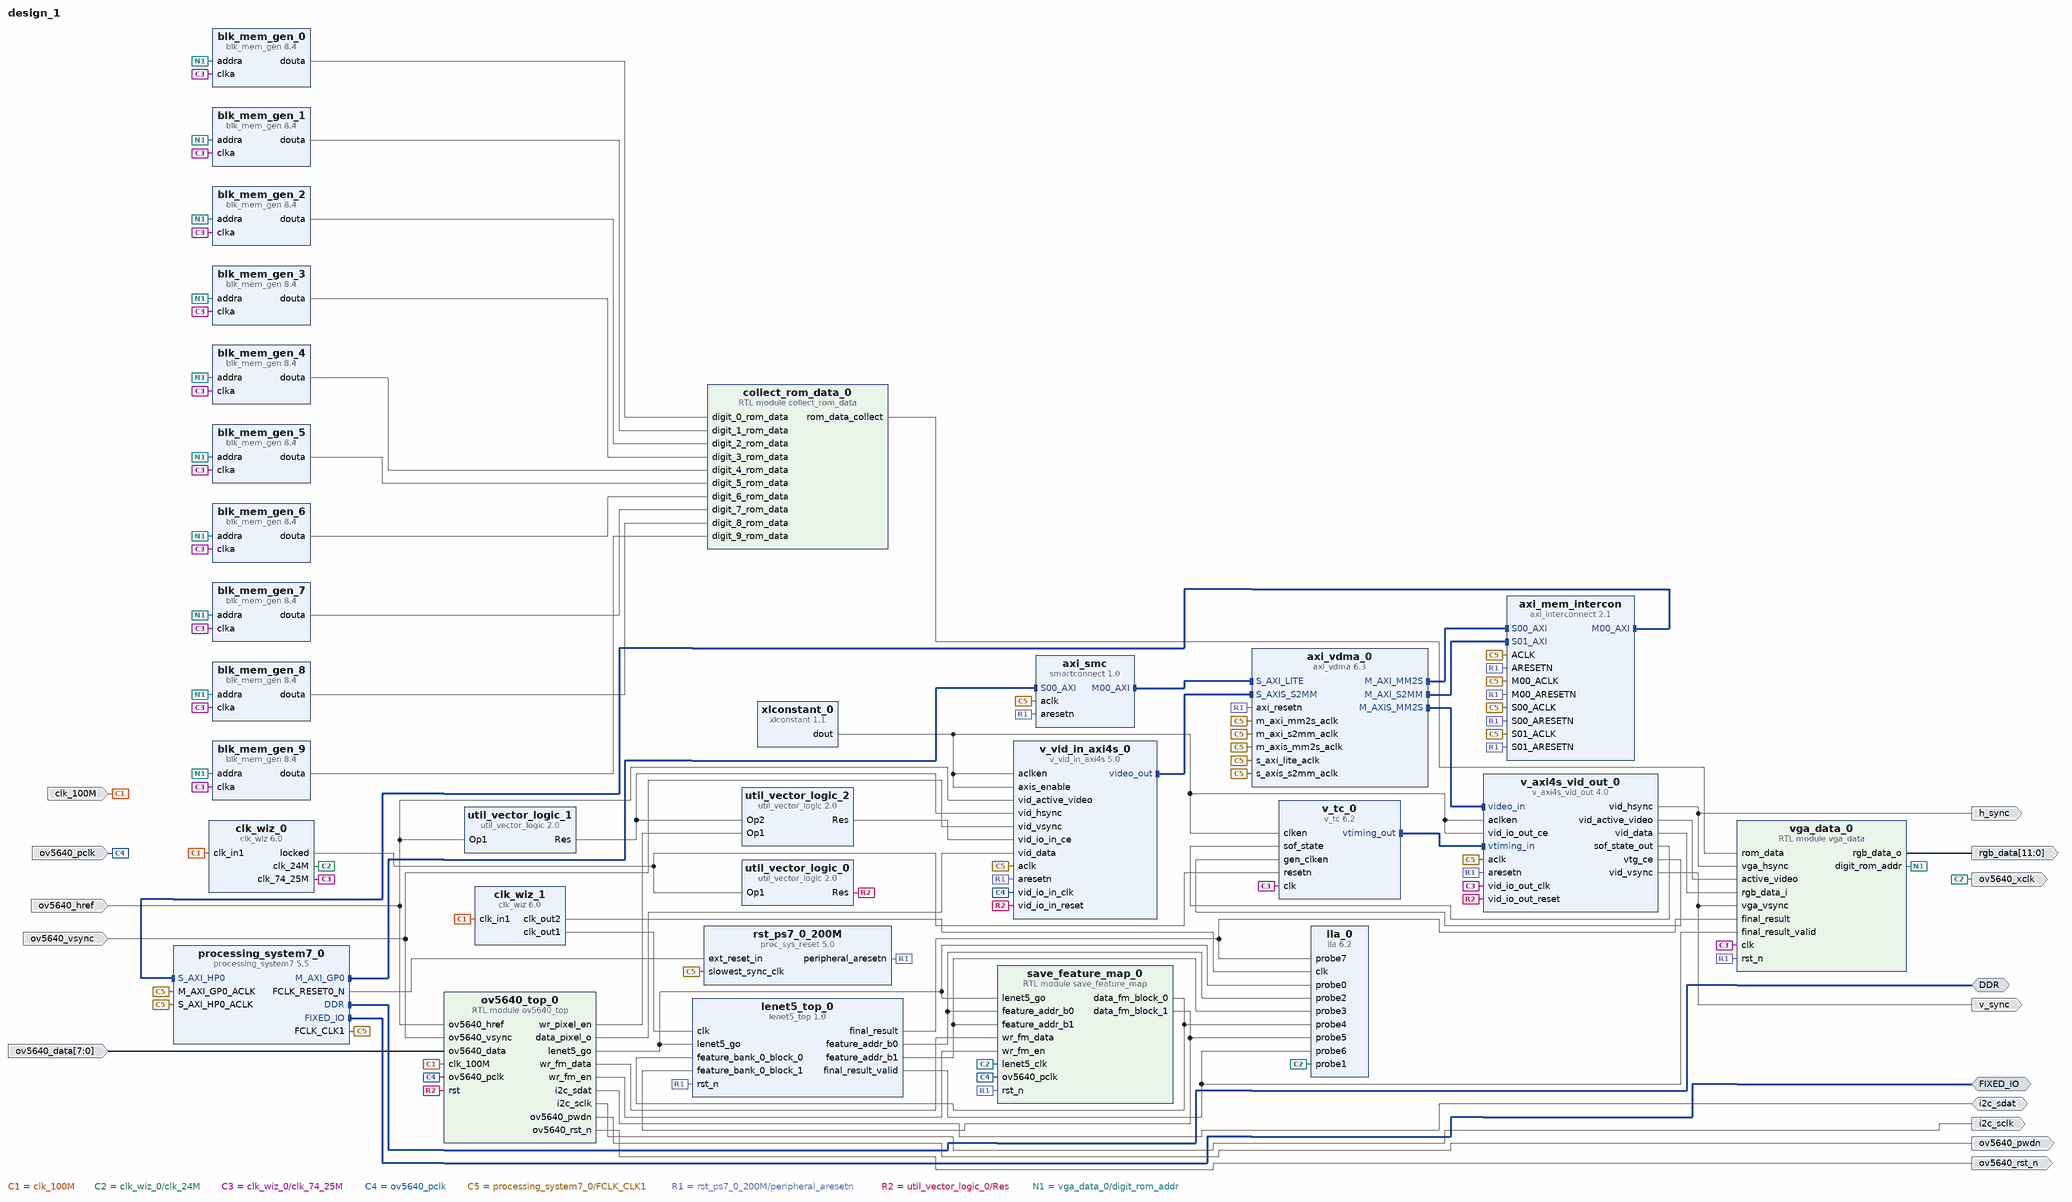
[diagram p0: block diagram of the top level]
# Vivado block design design_1, xc7z020clg484-1, Vivado 2024.2
create_bd_design design_1

create_bd_intf_port -mode Master -vlnv xilinx.com:interface:ddrx_rtl:1.0 DDR
create_bd_intf_port -mode Master -vlnv xilinx.com:display_processing_system7:fixedio_rtl:1.0 FIXED_IO
create_bd_port -dir O v_sync
create_bd_port -dir O h_sync
create_bd_port -dir O -from 11 -to 0 rgb_data
create_bd_port -dir I -type clk clk_100M
create_bd_port -dir I ov5640_pclk
create_bd_port -dir I ov5640_href
create_bd_port -dir I ov5640_vsync
create_bd_port -dir I -from 7 -to 0 ov5640_data
create_bd_port -dir O i2c_sclk
create_bd_port -dir IO i2c_sdat
create_bd_port -dir O ov5640_xclk
create_bd_port -dir O ov5640_pwdn
create_bd_port -dir O -type rst ov5640_rst_n

create_bd_cell -type ip -vlnv xilinx.com:ip:v_tc:6.2 v_tc_0
set_property -dict {CONFIG.HAS_AXI4_LITE false CONFIG.VIDEO_MODE 480p CONFIG.enable_detection false} [get_bd_cells v_tc_0]
create_bd_cell -type ip -vlnv xilinx.com:ip:v_axi4s_vid_out:4.0 v_axi4s_vid_out_0
set_property -dict [list \
  CONFIG.C_HAS_ASYNC_CLK 1 \
  CONFIG.C_NATIVE_COMPONENT_WIDTH 16 \
  CONFIG.C_S_AXIS_VIDEO_DATA_WIDTH 16 \
  CONFIG.C_S_AXIS_VIDEO_FORMAT 12 \
] [get_bd_cells v_axi4s_vid_out_0]
create_bd_cell -type ip -vlnv xilinx.com:ip:util_vector_logic:2.0 util_vector_logic_0
set_property -dict {CONFIG.C_OPERATION not CONFIG.C_SIZE 1} [get_bd_cells util_vector_logic_0]
create_bd_cell -type ip -vlnv xilinx.com:ip:axi_vdma:6.3 axi_vdma_0
set_property -dict [list \
  CONFIG.c_include_mm2s 1 \
  CONFIG.c_include_s2mm 1 \
  CONFIG.c_m_axis_mm2s_tdata_width 16 \
  CONFIG.c_mm2s_linebuffer_depth 2048 \
  CONFIG.c_mm2s_max_burst_length 32 \
  CONFIG.c_num_fstores 1 \
  CONFIG.c_s2mm_linebuffer_depth 2048 \
  CONFIG.c_s2mm_max_burst_length 32 \
] [get_bd_cells axi_vdma_0]
create_bd_cell -type ip -vlnv xilinx.com:ip:processing_system7:5.5 processing_system7_0
set_property -dict [list \
  CONFIG.PCW_APU_PERIPHERAL_FREQMHZ 666.666667 \
  CONFIG.PCW_ENET0_PERIPHERAL_ENABLE 0 \
  CONFIG.PCW_EN_CLK0_PORT 0 \
  CONFIG.PCW_EN_CLK1_PORT 1 \
  CONFIG.PCW_FCLK_CLK1_BUF TRUE \
  CONFIG.PCW_FPGA0_PERIPHERAL_FREQMHZ 40 \
  CONFIG.PCW_FPGA1_PERIPHERAL_FREQMHZ 200 \
  CONFIG.PCW_FPGA_FCLK1_ENABLE 1 \
  CONFIG.PCW_GPIO_MIO_GPIO_ENABLE 0 \
  CONFIG.PCW_PRESET_BANK1_VOLTAGE {LVCMOS 1.8V} \
  CONFIG.PCW_QSPI_PERIPHERAL_ENABLE 0 \
  CONFIG.PCW_SD0_PERIPHERAL_ENABLE 0 \
  CONFIG.PCW_UART1_PERIPHERAL_ENABLE 0 \
  CONFIG.PCW_UIPARAM_DDR_BUS_WIDTH {16 Bit} \
  CONFIG.PCW_UIPARAM_DDR_FREQ_MHZ 533.333313 \
  CONFIG.PCW_UIPARAM_DDR_PARTNO {MT41J128M16 HA-15E} \
  CONFIG.PCW_USB0_PERIPHERAL_ENABLE 0 \
  CONFIG.PCW_USE_S_AXI_HP0 1 \
  CONFIG.preset ZedBoard \
] [get_bd_cells processing_system7_0]
# 63 more settings of processing_system7_0 are not shown: defaults, MIO pin electricals, DDR timing, and values the tool derives
create_bd_cell -type ip -vlnv xilinx.com:ip:smartconnect:1.0 axi_smc
set_property -dict {CONFIG.NUM_MI 1 CONFIG.NUM_SI 1} [get_bd_cells axi_smc]
create_bd_cell -type ip -vlnv xilinx.com:ip:proc_sys_reset:5.0 rst_ps7_0_200M
create_bd_cell -type ip -vlnv xilinx.com:ip:axi_interconnect:2.1 axi_mem_intercon
set_property -dict {CONFIG.NUM_MI 1 CONFIG.NUM_SI 2} [get_bd_cells axi_mem_intercon]
create_bd_cell -type ip -vlnv xilinx.com:ip:xlconstant:1.1 xlconstant_0
create_bd_cell -type module -reference vga_data vga_data_0
create_bd_cell -type ip -vlnv xilinx.com:ip:clk_wiz:6.0 clk_wiz_0
set_property -dict [list \
  CONFIG.CLKOUT1_JITTER 469.645 \
  CONFIG.CLKOUT1_PHASE_ERROR 476.991 \
  CONFIG.CLKOUT1_REQUESTED_OUT_FREQ 25.175 \
  CONFIG.CLKOUT1_USED true \
  CONFIG.CLKOUT2_JITTER 473.605 \
  CONFIG.CLKOUT2_PHASE_ERROR 476.991 \
  CONFIG.CLKOUT2_REQUESTED_OUT_FREQ 24 \
  CONFIG.CLKOUT2_USED true \
  CONFIG.CLK_OUT1_PORT clk_74_25M \
  CONFIG.CLK_OUT2_PORT clk_24M \
  CONFIG.MMCM_CLKFBOUT_MULT_F 53.750 \
  CONFIG.MMCM_CLKOUT0_DIVIDE_F 30.500 \
  CONFIG.MMCM_CLKOUT1_DIVIDE 32 \
  CONFIG.MMCM_DIVCLK_DIVIDE 7 \
  CONFIG.NUM_OUT_CLKS 2 \
  CONFIG.USE_RESET false \
] [get_bd_cells clk_wiz_0]
create_bd_cell -type module -reference ov5640_top ov5640_top_0
create_bd_cell -type ip -vlnv xilinx.com:ip:v_vid_in_axi4s:5.0 v_vid_in_axi4s_0
set_property -dict [list \
  CONFIG.C_ADDR_WIDTH 11 \
  CONFIG.C_HAS_ASYNC_CLK 1 \
  CONFIG.C_M_AXIS_VIDEO_DATA_WIDTH 12 \
  CONFIG.C_M_AXIS_VIDEO_FORMAT 12 \
  CONFIG.C_NATIVE_COMPONENT_WIDTH 12 \
] [get_bd_cells v_vid_in_axi4s_0]
create_bd_cell -type ip -vlnv xilinx.com:ip:util_vector_logic:2.0 util_vector_logic_1
set_property -dict {CONFIG.C_OPERATION not CONFIG.C_SIZE 1} [get_bd_cells util_vector_logic_1]
create_bd_cell -type ip -vlnv xilinx.com:ip:blk_mem_gen:8.4 blk_mem_gen_0
set_property -dict [list \
  CONFIG.Coe_File ../../../../../../digit_coe/digit_0_8_16.coe \
  CONFIG.Enable_32bit_Address false \
  CONFIG.Enable_A Always_Enabled \
  CONFIG.Load_Init_File true \
  CONFIG.Memory_Type Single_Port_ROM \
  CONFIG.Register_PortA_Output_of_Memory_Primitives false \
  CONFIG.Write_Depth_A 128 \
  CONFIG.Write_Width_A 1 \
  CONFIG.use_bram_block Stand_Alone \
] [get_bd_cells blk_mem_gen_0]
create_bd_cell -type module -reference collect_rom_data collect_rom_data_0
create_bd_cell -type ip -vlnv xilinx.com:ip:blk_mem_gen:8.4 blk_mem_gen_1
set_property -dict [list \
  CONFIG.Coe_File ../../../../../../digit_coe/digit_1_8_16.coe \
  CONFIG.Enable_32bit_Address false \
  CONFIG.Enable_A Always_Enabled \
  CONFIG.Load_Init_File true \
  CONFIG.Memory_Type Single_Port_ROM \
  CONFIG.Register_PortA_Output_of_Memory_Primitives false \
  CONFIG.Write_Depth_A 128 \
  CONFIG.Write_Width_A 1 \
  CONFIG.use_bram_block Stand_Alone \
] [get_bd_cells blk_mem_gen_1]
create_bd_cell -type ip -vlnv xilinx.com:ip:blk_mem_gen:8.4 blk_mem_gen_2
set_property -dict [list \
  CONFIG.Coe_File ../../../../../../digit_coe/digit_2_8_16.coe \
  CONFIG.Enable_32bit_Address false \
  CONFIG.Enable_A Always_Enabled \
  CONFIG.Load_Init_File true \
  CONFIG.Memory_Type Single_Port_ROM \
  CONFIG.Register_PortA_Output_of_Memory_Primitives false \
  CONFIG.Write_Depth_A 128 \
  CONFIG.Write_Width_A 1 \
  CONFIG.use_bram_block Stand_Alone \
] [get_bd_cells blk_mem_gen_2]
create_bd_cell -type ip -vlnv xilinx.com:ip:blk_mem_gen:8.4 blk_mem_gen_3
set_property -dict [list \
  CONFIG.Coe_File ../../../../../../digit_coe/digit_3_8_16.coe \
  CONFIG.Enable_32bit_Address false \
  CONFIG.Enable_A Always_Enabled \
  CONFIG.Load_Init_File true \
  CONFIG.Memory_Type Single_Port_ROM \
  CONFIG.Register_PortA_Output_of_Memory_Primitives false \
  CONFIG.Write_Depth_A 128 \
  CONFIG.Write_Width_A 1 \
  CONFIG.use_bram_block Stand_Alone \
] [get_bd_cells blk_mem_gen_3]
create_bd_cell -type ip -vlnv xilinx.com:ip:blk_mem_gen:8.4 blk_mem_gen_4
set_property -dict [list \
  CONFIG.Coe_File ../../../../../../digit_coe/digit_4_8_16.coe \
  CONFIG.Enable_32bit_Address false \
  CONFIG.Enable_A Always_Enabled \
  CONFIG.Load_Init_File true \
  CONFIG.Memory_Type Single_Port_ROM \
  CONFIG.Register_PortA_Output_of_Memory_Primitives false \
  CONFIG.Write_Depth_A 128 \
  CONFIG.Write_Width_A 1 \
  CONFIG.use_bram_block Stand_Alone \
] [get_bd_cells blk_mem_gen_4]
create_bd_cell -type ip -vlnv xilinx.com:ip:blk_mem_gen:8.4 blk_mem_gen_5
set_property -dict [list \
  CONFIG.Coe_File ../../../../../../digit_coe/digit_5_8_16.coe \
  CONFIG.Enable_32bit_Address false \
  CONFIG.Enable_A Always_Enabled \
  CONFIG.Load_Init_File true \
  CONFIG.Memory_Type Single_Port_ROM \
  CONFIG.Register_PortA_Output_of_Memory_Primitives false \
  CONFIG.Write_Depth_A 128 \
  CONFIG.Write_Width_A 1 \
  CONFIG.use_bram_block Stand_Alone \
] [get_bd_cells blk_mem_gen_5]
create_bd_cell -type ip -vlnv xilinx.com:ip:blk_mem_gen:8.4 blk_mem_gen_6
set_property -dict [list \
  CONFIG.Coe_File ../../../../../../digit_coe/digit_6_8_16.coe \
  CONFIG.Enable_32bit_Address false \
  CONFIG.Enable_A Always_Enabled \
  CONFIG.Load_Init_File true \
  CONFIG.Memory_Type Single_Port_ROM \
  CONFIG.Register_PortA_Output_of_Memory_Primitives false \
  CONFIG.Write_Depth_A 128 \
  CONFIG.Write_Width_A 1 \
  CONFIG.use_bram_block Stand_Alone \
] [get_bd_cells blk_mem_gen_6]
create_bd_cell -type ip -vlnv xilinx.com:ip:blk_mem_gen:8.4 blk_mem_gen_7
set_property -dict [list \
  CONFIG.Coe_File ../../../../../../digit_coe/digit_7_8_16.coe \
  CONFIG.Enable_32bit_Address false \
  CONFIG.Enable_A Always_Enabled \
  CONFIG.Load_Init_File true \
  CONFIG.Memory_Type Single_Port_ROM \
  CONFIG.Register_PortA_Output_of_Memory_Primitives false \
  CONFIG.Write_Depth_A 128 \
  CONFIG.Write_Width_A 1 \
  CONFIG.use_bram_block Stand_Alone \
] [get_bd_cells blk_mem_gen_7]
create_bd_cell -type ip -vlnv xilinx.com:ip:blk_mem_gen:8.4 blk_mem_gen_8
set_property -dict [list \
  CONFIG.Coe_File ../../../../../../digit_coe/digit_8_8_16.coe \
  CONFIG.Enable_32bit_Address false \
  CONFIG.Enable_A Always_Enabled \
  CONFIG.Load_Init_File true \
  CONFIG.Memory_Type Single_Port_ROM \
  CONFIG.Register_PortA_Output_of_Memory_Primitives false \
  CONFIG.Write_Depth_A 128 \
  CONFIG.Write_Width_A 1 \
  CONFIG.use_bram_block Stand_Alone \
] [get_bd_cells blk_mem_gen_8]
create_bd_cell -type ip -vlnv xilinx.com:ip:blk_mem_gen:8.4 blk_mem_gen_9
set_property -dict [list \
  CONFIG.Coe_File ../../../../../../digit_coe/digit_9_8_16.coe \
  CONFIG.Enable_32bit_Address false \
  CONFIG.Enable_A Always_Enabled \
  CONFIG.Load_Init_File true \
  CONFIG.Memory_Type Single_Port_ROM \
  CONFIG.Register_PortA_Output_of_Memory_Primitives false \
  CONFIG.Write_Depth_A 128 \
  CONFIG.Write_Width_A 1 \
  CONFIG.use_bram_block Stand_Alone \
] [get_bd_cells blk_mem_gen_9]
create_bd_cell -type ip -vlnv xilinx.com:ip:util_vector_logic:2.0 util_vector_logic_2
set_property -dict {CONFIG.C_OPERATION or CONFIG.C_SIZE 1} [get_bd_cells util_vector_logic_2]
create_bd_cell -type module -reference save_feature_map save_feature_map_0
create_bd_cell -type ip -vlnv xilinx.com:ip:ila:6.2 ila_0
set_property -dict [list \
  CONFIG.C_DATA_DEPTH 8192 \
  CONFIG.C_MONITOR_TYPE Native \
  CONFIG.C_NUM_OF_PROBES 8 \
  CONFIG.C_PROBE2_WIDTH 7 \
  CONFIG.C_PROBE3_WIDTH 7 \
  CONFIG.C_PROBE4_WIDTH 40 \
  CONFIG.C_PROBE5_WIDTH 40 \
  CONFIG.C_PROBE7_WIDTH 4 \
  CONFIG.C_PROBE8_WIDTH 1 \
] [get_bd_cells ila_0]
create_bd_cell -type ip -vlnv xilinx.com:user:lenet5_top:1.0 lenet5_top_0
create_bd_cell -type ip -vlnv xilinx.com:ip:clk_wiz:6.0 clk_wiz_1
set_property -dict [list \
  CONFIG.CLKOUT1_JITTER 138.050 \
  CONFIG.CLKOUT1_PHASE_ERROR 99.281 \
  CONFIG.CLKOUT1_REQUESTED_OUT_FREQ 75.000 \
  CONFIG.CLKOUT2_JITTER 138.050 \
  CONFIG.CLKOUT2_PHASE_ERROR 99.281 \
  CONFIG.CLKOUT2_REQUESTED_OUT_FREQ 75.000 \
  CONFIG.CLKOUT2_USED true \
  CONFIG.MMCM_CLKFBOUT_MULT_F 9.750 \
  CONFIG.MMCM_CLKIN1_PERIOD 10.000 \
  CONFIG.MMCM_CLKIN2_PERIOD 10.000 \
  CONFIG.MMCM_CLKOUT0_DIVIDE_F 13.000 \
  CONFIG.MMCM_CLKOUT1_DIVIDE 13 \
  CONFIG.MMCM_DIVCLK_DIVIDE 1 \
  CONFIG.NUM_OUT_CLKS 2 \
  CONFIG.USE_LOCKED false \
  CONFIG.USE_RESET false \
] [get_bd_cells clk_wiz_1]

# ---- connections ----

connect_bd_intf_net [get_bd_intf_pins axi_mem_intercon/M00_AXI] [get_bd_intf_pins processing_system7_0/S_AXI_HP0]
connect_bd_intf_net [get_bd_intf_pins axi_smc/M00_AXI] [get_bd_intf_pins axi_vdma_0/S_AXI_LITE]
connect_bd_intf_net [get_bd_intf_pins axi_vdma_0/M_AXIS_MM2S] [get_bd_intf_pins v_axi4s_vid_out_0/video_in]
connect_bd_intf_net [get_bd_intf_pins axi_vdma_0/M_AXI_MM2S] [get_bd_intf_pins axi_mem_intercon/S00_AXI]
connect_bd_intf_net [get_bd_intf_pins axi_vdma_0/M_AXI_S2MM] [get_bd_intf_pins axi_mem_intercon/S01_AXI]
connect_bd_intf_net [get_bd_intf_ports DDR] [get_bd_intf_pins processing_system7_0/DDR]
connect_bd_intf_net [get_bd_intf_ports FIXED_IO] [get_bd_intf_pins processing_system7_0/FIXED_IO]
connect_bd_intf_net [get_bd_intf_pins processing_system7_0/M_AXI_GP0] [get_bd_intf_pins axi_smc/S00_AXI]
connect_bd_intf_net [get_bd_intf_pins v_tc_0/vtiming_out] [get_bd_intf_pins v_axi4s_vid_out_0/vtiming_in]
connect_bd_intf_net [get_bd_intf_pins axi_vdma_0/S_AXIS_S2MM] [get_bd_intf_pins v_vid_in_axi4s_0/video_out]
connect_bd_net [get_bd_ports i2c_sdat] [get_bd_pins ov5640_top_0/i2c_sdat]
connect_bd_net [get_bd_pins blk_mem_gen_0/douta] [get_bd_pins collect_rom_data_0/digit_0_rom_data]
connect_bd_net [get_bd_pins blk_mem_gen_1/douta] [get_bd_pins collect_rom_data_0/digit_1_rom_data]
connect_bd_net [get_bd_pins blk_mem_gen_2/douta] [get_bd_pins collect_rom_data_0/digit_2_rom_data]
connect_bd_net [get_bd_pins blk_mem_gen_3/douta] [get_bd_pins collect_rom_data_0/digit_3_rom_data]
connect_bd_net [get_bd_pins blk_mem_gen_4/douta] [get_bd_pins collect_rom_data_0/digit_4_rom_data]
connect_bd_net [get_bd_pins blk_mem_gen_5/douta] [get_bd_pins collect_rom_data_0/digit_5_rom_data]
connect_bd_net [get_bd_pins blk_mem_gen_6/douta] [get_bd_pins collect_rom_data_0/digit_6_rom_data]
connect_bd_net [get_bd_pins blk_mem_gen_7/douta] [get_bd_pins collect_rom_data_0/digit_7_rom_data]
connect_bd_net [get_bd_pins blk_mem_gen_8/douta] [get_bd_pins collect_rom_data_0/digit_8_rom_data]
connect_bd_net [get_bd_pins blk_mem_gen_9/douta] [get_bd_pins collect_rom_data_0/digit_9_rom_data]
connect_bd_net -net clk_in1_0_1 [get_bd_ports clk_100M] \
  [get_bd_pins clk_wiz_0/clk_in1] [get_bd_pins ov5640_top_0/clk_100M] [get_bd_pins clk_wiz_1/clk_in1]
connect_bd_net [get_bd_pins clk_wiz_0/clk_24M] [get_bd_ports ov5640_xclk] [get_bd_pins ila_0/probe1] [get_bd_pins save_feature_map_0/lenet5_clk]
connect_bd_net [get_bd_pins clk_wiz_0/clk_74_25M] \
  [get_bd_pins v_tc_0/clk] [get_bd_pins v_axi4s_vid_out_0/vid_io_out_clk] [get_bd_pins blk_mem_gen_0/clka] \
  [get_bd_pins blk_mem_gen_1/clka] [get_bd_pins blk_mem_gen_2/clka] [get_bd_pins blk_mem_gen_3/clka] \
  [get_bd_pins blk_mem_gen_7/clka] [get_bd_pins blk_mem_gen_9/clka] [get_bd_pins blk_mem_gen_8/clka] \
  [get_bd_pins blk_mem_gen_6/clka] [get_bd_pins blk_mem_gen_5/clka] [get_bd_pins blk_mem_gen_4/clka] \
  [get_bd_pins vga_data_0/clk]
connect_bd_net -net clk_wiz_0_locked [get_bd_pins xlconstant_0/dout] \
  [get_bd_pins v_tc_0/clken] [get_bd_pins v_axi4s_vid_out_0/vid_io_out_ce] [get_bd_pins v_axi4s_vid_out_0/aclken] \
  [get_bd_pins v_vid_in_axi4s_0/aclken] [get_bd_pins v_vid_in_axi4s_0/axis_enable]
connect_bd_net [get_bd_pins clk_wiz_0/locked] [get_bd_pins v_tc_0/resetn] [get_bd_pins util_vector_logic_0/Op1]
connect_bd_net [get_bd_pins clk_wiz_1/clk_out1] [get_bd_pins lenet5_top_0/clk]
connect_bd_net [get_bd_pins clk_wiz_1/clk_out2] [get_bd_pins ila_0/clk]
connect_bd_net [get_bd_pins collect_rom_data_0/rom_data_collect] [get_bd_pins vga_data_0/rom_data]
connect_bd_net [get_bd_pins lenet5_top_0/feature_addr_b0] [get_bd_pins ila_0/probe2] [get_bd_pins save_feature_map_0/feature_addr_b0]
connect_bd_net [get_bd_pins lenet5_top_0/feature_addr_b1] [get_bd_pins ila_0/probe3] [get_bd_pins save_feature_map_0/feature_addr_b1]
connect_bd_net [get_bd_pins lenet5_top_0/final_result] [get_bd_pins ila_0/probe7] [get_bd_pins vga_data_0/final_result]
connect_bd_net [get_bd_pins lenet5_top_0/final_result_valid] [get_bd_pins ila_0/probe6] [get_bd_pins vga_data_0/final_result_valid]
connect_bd_net -net ov5640_data_0_1 [get_bd_ports ov5640_data] [get_bd_pins ov5640_top_0/ov5640_data]
connect_bd_net -net ov5640_href_0_1 [get_bd_ports ov5640_href] \
  [get_bd_pins util_vector_logic_1/Op1] [get_bd_pins v_vid_in_axi4s_0/vid_active_video] \
  [get_bd_pins ov5640_top_0/ov5640_href]
connect_bd_net [get_bd_ports ov5640_pclk] \
  [get_bd_pins v_vid_in_axi4s_0/vid_io_in_clk] [get_bd_pins ov5640_top_0/ov5640_pclk] \
  [get_bd_pins save_feature_map_0/ov5640_pclk]
connect_bd_net -net ov5640_top_0_data_pixel [get_bd_pins ov5640_top_0/data_pixel_o] [get_bd_pins v_vid_in_axi4s_0/vid_data]
connect_bd_net [get_bd_pins ov5640_top_0/i2c_sclk] [get_bd_ports i2c_sclk]
connect_bd_net [get_bd_pins ov5640_top_0/lenet5_go] \
  [get_bd_pins ila_0/probe0] [get_bd_pins lenet5_top_0/lenet5_go] [get_bd_pins save_feature_map_0/lenet5_go]
connect_bd_net [get_bd_pins ov5640_top_0/ov5640_pwdn] [get_bd_ports ov5640_pwdn]
connect_bd_net [get_bd_pins ov5640_top_0/ov5640_rst_n] [get_bd_ports ov5640_rst_n]
connect_bd_net [get_bd_pins ov5640_top_0/wr_fm_data] [get_bd_pins save_feature_map_0/wr_fm_data]
connect_bd_net [get_bd_pins ov5640_top_0/wr_fm_en] [get_bd_pins save_feature_map_0/wr_fm_en]
connect_bd_net [get_bd_pins ov5640_top_0/wr_pixel_en] [get_bd_pins util_vector_logic_2/Op1]
connect_bd_net -net ov5640_vsync_0_1 [get_bd_ports ov5640_vsync] [get_bd_pins v_vid_in_axi4s_0/vid_vsync] [get_bd_pins ov5640_top_0/ov5640_vsync]
connect_bd_net [get_bd_pins processing_system7_0/FCLK_CLK1] \
  [get_bd_pins v_axi4s_vid_out_0/aclk] [get_bd_pins axi_vdma_0/m_axi_mm2s_aclk] [get_bd_pins axi_vdma_0/m_axis_mm2s_aclk] \
  [get_bd_pins axi_vdma_0/s_axi_lite_aclk] [get_bd_pins axi_smc/aclk] [get_bd_pins rst_ps7_0_200M/slowest_sync_clk] \
  [get_bd_pins processing_system7_0/M_AXI_GP0_ACLK] [get_bd_pins axi_mem_intercon/S00_ACLK] \
  [get_bd_pins processing_system7_0/S_AXI_HP0_ACLK] [get_bd_pins axi_mem_intercon/M00_ACLK] \
  [get_bd_pins axi_mem_intercon/ACLK] [get_bd_pins v_vid_in_axi4s_0/aclk] [get_bd_pins axi_vdma_0/m_axi_s2mm_aclk] \
  [get_bd_pins axi_mem_intercon/S01_ACLK] [get_bd_pins axi_vdma_0/s_axis_s2mm_aclk]
connect_bd_net [get_bd_pins processing_system7_0/FCLK_RESET0_N] [get_bd_pins rst_ps7_0_200M/ext_reset_in]
connect_bd_net [get_bd_pins rst_ps7_0_200M/peripheral_aresetn] \
  [get_bd_pins axi_vdma_0/axi_resetn] [get_bd_pins axi_smc/aresetn] [get_bd_pins axi_mem_intercon/S00_ARESETN] \
  [get_bd_pins axi_mem_intercon/M00_ARESETN] [get_bd_pins axi_mem_intercon/ARESETN] [get_bd_pins v_axi4s_vid_out_0/aresetn] \
  [get_bd_pins v_vid_in_axi4s_0/aresetn] [get_bd_pins axi_mem_intercon/S01_ARESETN] [get_bd_pins lenet5_top_0/rst_n] \
  [get_bd_pins save_feature_map_0/rst_n] [get_bd_pins vga_data_0/rst_n]
connect_bd_net [get_bd_pins save_feature_map_0/data_fm_block_0] [get_bd_pins ila_0/probe4] [get_bd_pins lenet5_top_0/feature_bank_0_block_0]
connect_bd_net [get_bd_pins save_feature_map_0/data_fm_block_1] [get_bd_pins ila_0/probe5] [get_bd_pins lenet5_top_0/feature_bank_0_block_1]
connect_bd_net [get_bd_pins util_vector_logic_0/Res] \
  [get_bd_pins v_axi4s_vid_out_0/vid_io_out_reset] [get_bd_pins v_vid_in_axi4s_0/vid_io_in_reset] \
  [get_bd_pins ov5640_top_0/rst]
connect_bd_net [get_bd_pins util_vector_logic_1/Res] [get_bd_pins v_vid_in_axi4s_0/vid_hsync] [get_bd_pins util_vector_logic_2/Op2]
connect_bd_net [get_bd_pins util_vector_logic_2/Res] [get_bd_pins v_vid_in_axi4s_0/vid_io_in_ce]
connect_bd_net [get_bd_pins v_axi4s_vid_out_0/sof_state_out] [get_bd_pins v_tc_0/sof_state]
connect_bd_net [get_bd_pins v_axi4s_vid_out_0/vid_active_video] [get_bd_pins vga_data_0/active_video]
connect_bd_net [get_bd_pins v_axi4s_vid_out_0/vid_data] [get_bd_pins vga_data_0/rgb_data_i]
connect_bd_net [get_bd_pins v_axi4s_vid_out_0/vid_hsync] [get_bd_ports h_sync] [get_bd_pins vga_data_0/vga_hsync]
connect_bd_net [get_bd_pins v_axi4s_vid_out_0/vid_vsync] [get_bd_ports v_sync] [get_bd_pins vga_data_0/vga_vsync]
connect_bd_net [get_bd_pins v_axi4s_vid_out_0/vtg_ce] [get_bd_pins v_tc_0/gen_clken]
connect_bd_net [get_bd_pins vga_data_0/digit_rom_addr] \
  [get_bd_pins blk_mem_gen_0/addra] [get_bd_pins blk_mem_gen_1/addra] [get_bd_pins blk_mem_gen_2/addra] \
  [get_bd_pins blk_mem_gen_3/addra] [get_bd_pins blk_mem_gen_7/addra] [get_bd_pins blk_mem_gen_9/addra] \
  [get_bd_pins blk_mem_gen_8/addra] [get_bd_pins blk_mem_gen_6/addra] [get_bd_pins blk_mem_gen_5/addra] \
  [get_bd_pins blk_mem_gen_4/addra]
connect_bd_net [get_bd_pins vga_data_0/rgb_data_o] [get_bd_ports rgb_data]

# ---- address map ----
assign_bd_address -offset 0x00000000 -range 256M -target_address_space [get_bd_addr_spaces axi_vdma_0/Data_MM2S] [get_bd_addr_segs processing_system7_0/S_AXI_HP0/HP0_DDR_LOWOCM]
assign_bd_address -offset 0x00000000 -range 256M -target_address_space [get_bd_addr_spaces axi_vdma_0/Data_S2MM] [get_bd_addr_segs processing_system7_0/S_AXI_HP0/HP0_DDR_LOWOCM]
assign_bd_address -offset 0x43000000 -range 64K -target_address_space [get_bd_addr_spaces processing_system7_0/Data] [get_bd_addr_segs axi_vdma_0/S_AXI_LITE/Reg]

validate_bd_design
save_bd_design
